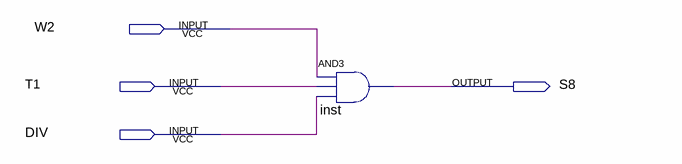
[diagram p0: schematic sheet]
// Quartus schematic S8.bdf as structural Verilog: 1 symbols, 4 pins
module S8 (
  input  W2,
  input  T1,
  input  DIV,
  output S8
);

  and inst (S8, W2, T1, DIV);
endmodule
